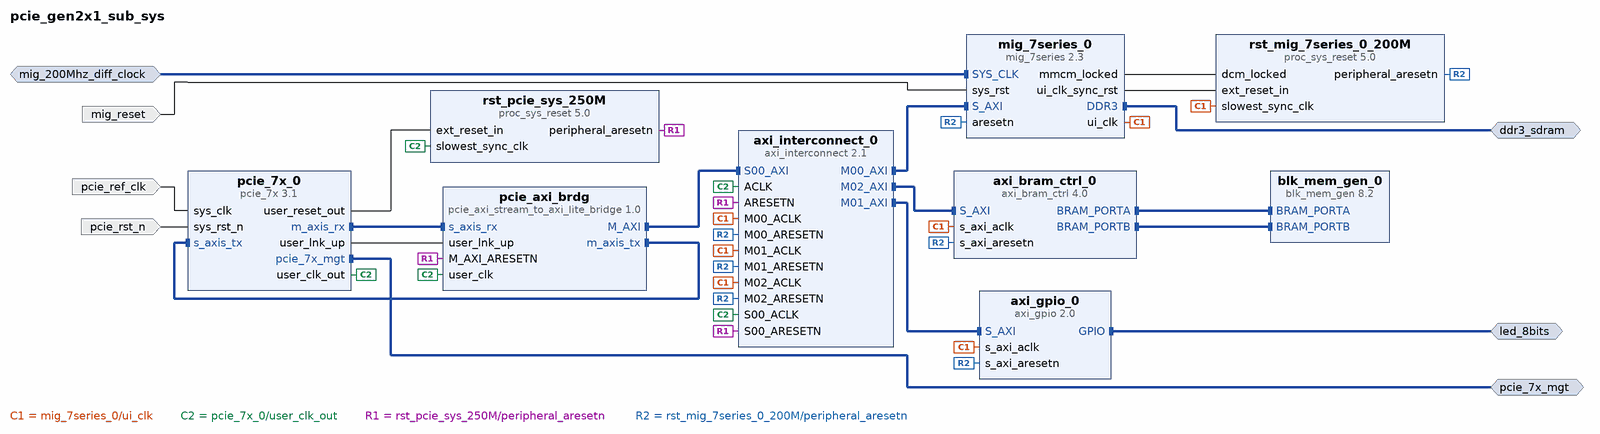
[diagram p0: block diagram of the top level]
# Vivado block design pcie_gen2x1_sub_sys, Vivado 2015.2
create_bd_design pcie_gen2x1_sub_sys

create_bd_intf_port -mode Master -vlnv xilinx.com:interface:ddrx_rtl:1.0 ddr3_sdram
create_bd_intf_port -mode Master -vlnv xilinx.com:interface:gpio_rtl:1.0 led_8bits
create_bd_intf_port -mode Slave -vlnv xilinx.com:interface:diff_clock_rtl:1.0 mig_200Mhz_diff_clock
set_property -dict {CONFIG.FREQ_HZ 200000000} [get_bd_intf_ports mig_200Mhz_diff_clock]
create_bd_intf_port -mode Master -vlnv xilinx.com:interface:pcie_7x_mgt_rtl:1.0 pcie_7x_mgt
create_bd_port -dir I -type rst mig_reset
set_property -dict {CONFIG.POLARITY ACTIVE_HIGH} [get_bd_ports mig_reset]
create_bd_port -dir I -type clk pcie_ref_clk
create_bd_port -dir I -type rst pcie_rst_n

create_bd_cell -type ip -vlnv xilinx.com:ip:axi_bram_ctrl:4.0 axi_bram_ctrl_0
set_property -dict {CONFIG.SUPPORTS_NARROW_BURST 0} [get_bd_cells axi_bram_ctrl_0]
create_bd_cell -type ip -vlnv xilinx.com:ip:axi_gpio:2.0 axi_gpio_0
set_property -dict {CONFIG.USE_BOARD_FLOW true CONFIG.GPIO_BOARD_INTERFACE led_8bits} [get_bd_cells axi_gpio_0]
create_bd_cell -type ip -vlnv xilinx.com:ip:axi_interconnect:2.1 axi_interconnect_0
set_property -dict {CONFIG.NUM_MI 3 CONFIG.S00_HAS_REGSLICE 3} [get_bd_cells axi_interconnect_0]
create_bd_cell -type ip -vlnv xilinx.com:ip:blk_mem_gen:8.2 blk_mem_gen_0
set_property -dict [list \
  CONFIG.Memory_Type True_Dual_Port_RAM \
  CONFIG.Enable_B Use_ENB_Pin \
  CONFIG.Use_RSTB_Pin true \
  CONFIG.Port_B_Clock 100 \
  CONFIG.Port_B_Write_Rate 50 \
  CONFIG.Port_B_Enable_Rate 100 \
] [get_bd_cells blk_mem_gen_0]
create_bd_cell -type ip -vlnv xilinx.com:ip:mig_7series:2.3 mig_7series_0
set_property -dict [list \
  CONFIG.XML_INPUT_FILE mig_a.prj \
  CONFIG.RESET_BOARD_INTERFACE reset \
  CONFIG.MIG_DONT_TOUCH_PARAM Custom \
] [get_bd_cells mig_7series_0]
create_bd_cell -type ip -vlnv xilinx.com:ip:pcie_7x:3.1 pcie_7x_0
set_property -dict [list \
  CONFIG.mode_selection Advanced \
  CONFIG.Maximum_Link_Width X1 \
  CONFIG.Link_Speed 5.0_GT/s \
  CONFIG.Interface_Width 64_bit \
  CONFIG.User_Clk_Freq 62.5 \
  CONFIG.Bar0_Scale Gigabytes \
  CONFIG.Bar0_Size 1 \
  CONFIG.Bar1_Enabled true \
  CONFIG.Bar1_Type Memory \
  CONFIG.Bar1_Size 64 \
  CONFIG.Bar2_Enabled false \
  CONFIG.Bar3_Enabled false \
  CONFIG.Device_ID 7021 \
  CONFIG.Max_Payload_Size 512_bytes \
  CONFIG.Trgt_Link_Speed {4'h2} \
  CONFIG.Xlnx_Ref_Board KC705_REVC \
  CONFIG.en_ext_clk false \
  CONFIG.pl_interface false \
  CONFIG.cfg_mgmt_if false \
  CONFIG.cfg_ctl_if false \
  CONFIG.cfg_status_if false \
  CONFIG.rcv_msg_if false \
  CONFIG.cfg_fc_if false \
  CONFIG.err_reporting_if false \
] [get_bd_cells pcie_7x_0]
create_bd_cell -type ip -vlnv sanjayr:user:pcie_axi_stream_to_axi_lite_bridge:1.0 pcie_axi_brdg
set_property -dict [list \
  CONFIG.C_DATA_WIDTH 64 \
  CONFIG.AXI_BAR_0_ADDR 0x20000000 \
  CONFIG.AXI_BAR_0_MASK 0xC0000000 \
  CONFIG.AXI_BAR_1_ADDR 0x40000000 \
  CONFIG.AXI_BAR_1_MASK 0xFFFF0000 \
  CONFIG.AXI_BAR_2_ADDR 0x60000000 \
  CONFIG.AXI_BAR_3_ADDR 0x80000000 \
] [get_bd_cells pcie_axi_brdg]
create_bd_cell -type ip -vlnv xilinx.com:ip:proc_sys_reset:5.0 rst_mig_7series_0_200M
set_property -dict {CONFIG.C_AUX_RESET_HIGH 0} [get_bd_cells rst_mig_7series_0_200M]
create_bd_cell -type ip -vlnv xilinx.com:ip:proc_sys_reset:5.0 rst_pcie_sys_250M
set_property -dict {CONFIG.C_AUX_RESET_HIGH 0} [get_bd_cells rst_pcie_sys_250M]

# ---- connections ----

connect_bd_intf_net [get_bd_intf_pins axi_interconnect_0/S00_AXI] [get_bd_intf_pins pcie_axi_brdg/M_AXI]
connect_bd_intf_net [get_bd_intf_pins axi_bram_ctrl_0/BRAM_PORTA] [get_bd_intf_pins blk_mem_gen_0/BRAM_PORTA]
connect_bd_intf_net [get_bd_intf_pins axi_bram_ctrl_0/BRAM_PORTB] [get_bd_intf_pins blk_mem_gen_0/BRAM_PORTB]
connect_bd_intf_net [get_bd_intf_pins axi_interconnect_0/M00_AXI] [get_bd_intf_pins mig_7series_0/S_AXI]
connect_bd_intf_net [get_bd_intf_pins axi_gpio_0/S_AXI] [get_bd_intf_pins axi_interconnect_0/M01_AXI]
connect_bd_intf_net [get_bd_intf_pins axi_bram_ctrl_0/S_AXI] [get_bd_intf_pins axi_interconnect_0/M02_AXI]
connect_bd_intf_net [get_bd_intf_pins pcie_7x_0/m_axis_rx] [get_bd_intf_pins pcie_axi_brdg/s_axis_rx]
connect_bd_intf_net [get_bd_intf_pins pcie_7x_0/s_axis_tx] [get_bd_intf_pins pcie_axi_brdg/m_axis_tx]
connect_bd_intf_net [get_bd_intf_ports ddr3_sdram] [get_bd_intf_pins mig_7series_0/DDR3]
connect_bd_intf_net [get_bd_intf_ports led_8bits] [get_bd_intf_pins axi_gpio_0/GPIO]
connect_bd_intf_net -intf_net sys_diff_clock_1 [get_bd_intf_ports mig_200Mhz_diff_clock] [get_bd_intf_pins mig_7series_0/SYS_CLK]
connect_bd_intf_net [get_bd_intf_ports pcie_7x_mgt] [get_bd_intf_pins pcie_7x_0/pcie_7x_mgt]
connect_bd_net [get_bd_pins mig_7series_0/mmcm_locked] [get_bd_pins rst_mig_7series_0_200M/dcm_locked]
connect_bd_net [get_bd_pins mig_7series_0/ui_clk] \
  [get_bd_pins axi_bram_ctrl_0/s_axi_aclk] [get_bd_pins axi_gpio_0/s_axi_aclk] [get_bd_pins axi_interconnect_0/M00_ACLK] \
  [get_bd_pins axi_interconnect_0/M01_ACLK] [get_bd_pins axi_interconnect_0/M02_ACLK] \
  [get_bd_pins rst_mig_7series_0_200M/slowest_sync_clk]
connect_bd_net [get_bd_pins mig_7series_0/ui_clk_sync_rst] [get_bd_pins rst_mig_7series_0_200M/ext_reset_in]
connect_bd_net [get_bd_pins pcie_7x_0/user_clk_out] \
  [get_bd_pins axi_interconnect_0/ACLK] [get_bd_pins axi_interconnect_0/S00_ACLK] [get_bd_pins pcie_axi_brdg/user_clk] \
  [get_bd_pins rst_pcie_sys_250M/slowest_sync_clk]
connect_bd_net [get_bd_pins pcie_7x_0/user_lnk_up] [get_bd_pins pcie_axi_brdg/user_lnk_up]
connect_bd_net [get_bd_pins pcie_7x_0/user_reset_out] [get_bd_pins rst_pcie_sys_250M/ext_reset_in]
connect_bd_net -net reset_1 [get_bd_ports mig_reset] [get_bd_pins mig_7series_0/sys_rst]
connect_bd_net -net rst_mig_7series_0_200M1_peripheral_aresetn [get_bd_pins rst_pcie_sys_250M/peripheral_aresetn] \
  [get_bd_pins axi_interconnect_0/ARESETN] [get_bd_pins axi_interconnect_0/S00_ARESETN] \
  [get_bd_pins pcie_axi_brdg/M_AXI_ARESETN]
connect_bd_net [get_bd_pins rst_mig_7series_0_200M/peripheral_aresetn] \
  [get_bd_pins axi_bram_ctrl_0/s_axi_aresetn] [get_bd_pins axi_gpio_0/s_axi_aresetn] \
  [get_bd_pins axi_interconnect_0/M00_ARESETN] [get_bd_pins axi_interconnect_0/M01_ARESETN] \
  [get_bd_pins axi_interconnect_0/M02_ARESETN] [get_bd_pins mig_7series_0/aresetn]
connect_bd_net -net sys_clk_1 [get_bd_ports pcie_ref_clk] [get_bd_pins pcie_7x_0/sys_clk]
connect_bd_net -net sys_rst_n_1 [get_bd_ports pcie_rst_n] [get_bd_pins pcie_7x_0/sys_rst_n]

# ---- address map ----
assign_bd_address -offset 0x20000000 -range 512M -target_address_space [get_bd_addr_spaces pcie_axi_brdg/M_AXI] [get_bd_addr_segs mig_7series_0/memmap/memaddr]
assign_bd_address -offset 0x40000000 -range 16K -target_address_space [get_bd_addr_spaces pcie_axi_brdg/M_AXI] [get_bd_addr_segs axi_bram_ctrl_0/S_AXI/Mem0]
assign_bd_address -offset 0x40004000 -range 4K -target_address_space [get_bd_addr_spaces pcie_axi_brdg/M_AXI] [get_bd_addr_segs axi_gpio_0/S_AXI/Reg]

validate_bd_design
save_bd_design
